# EAGLE design board (EAGLE 6.4)
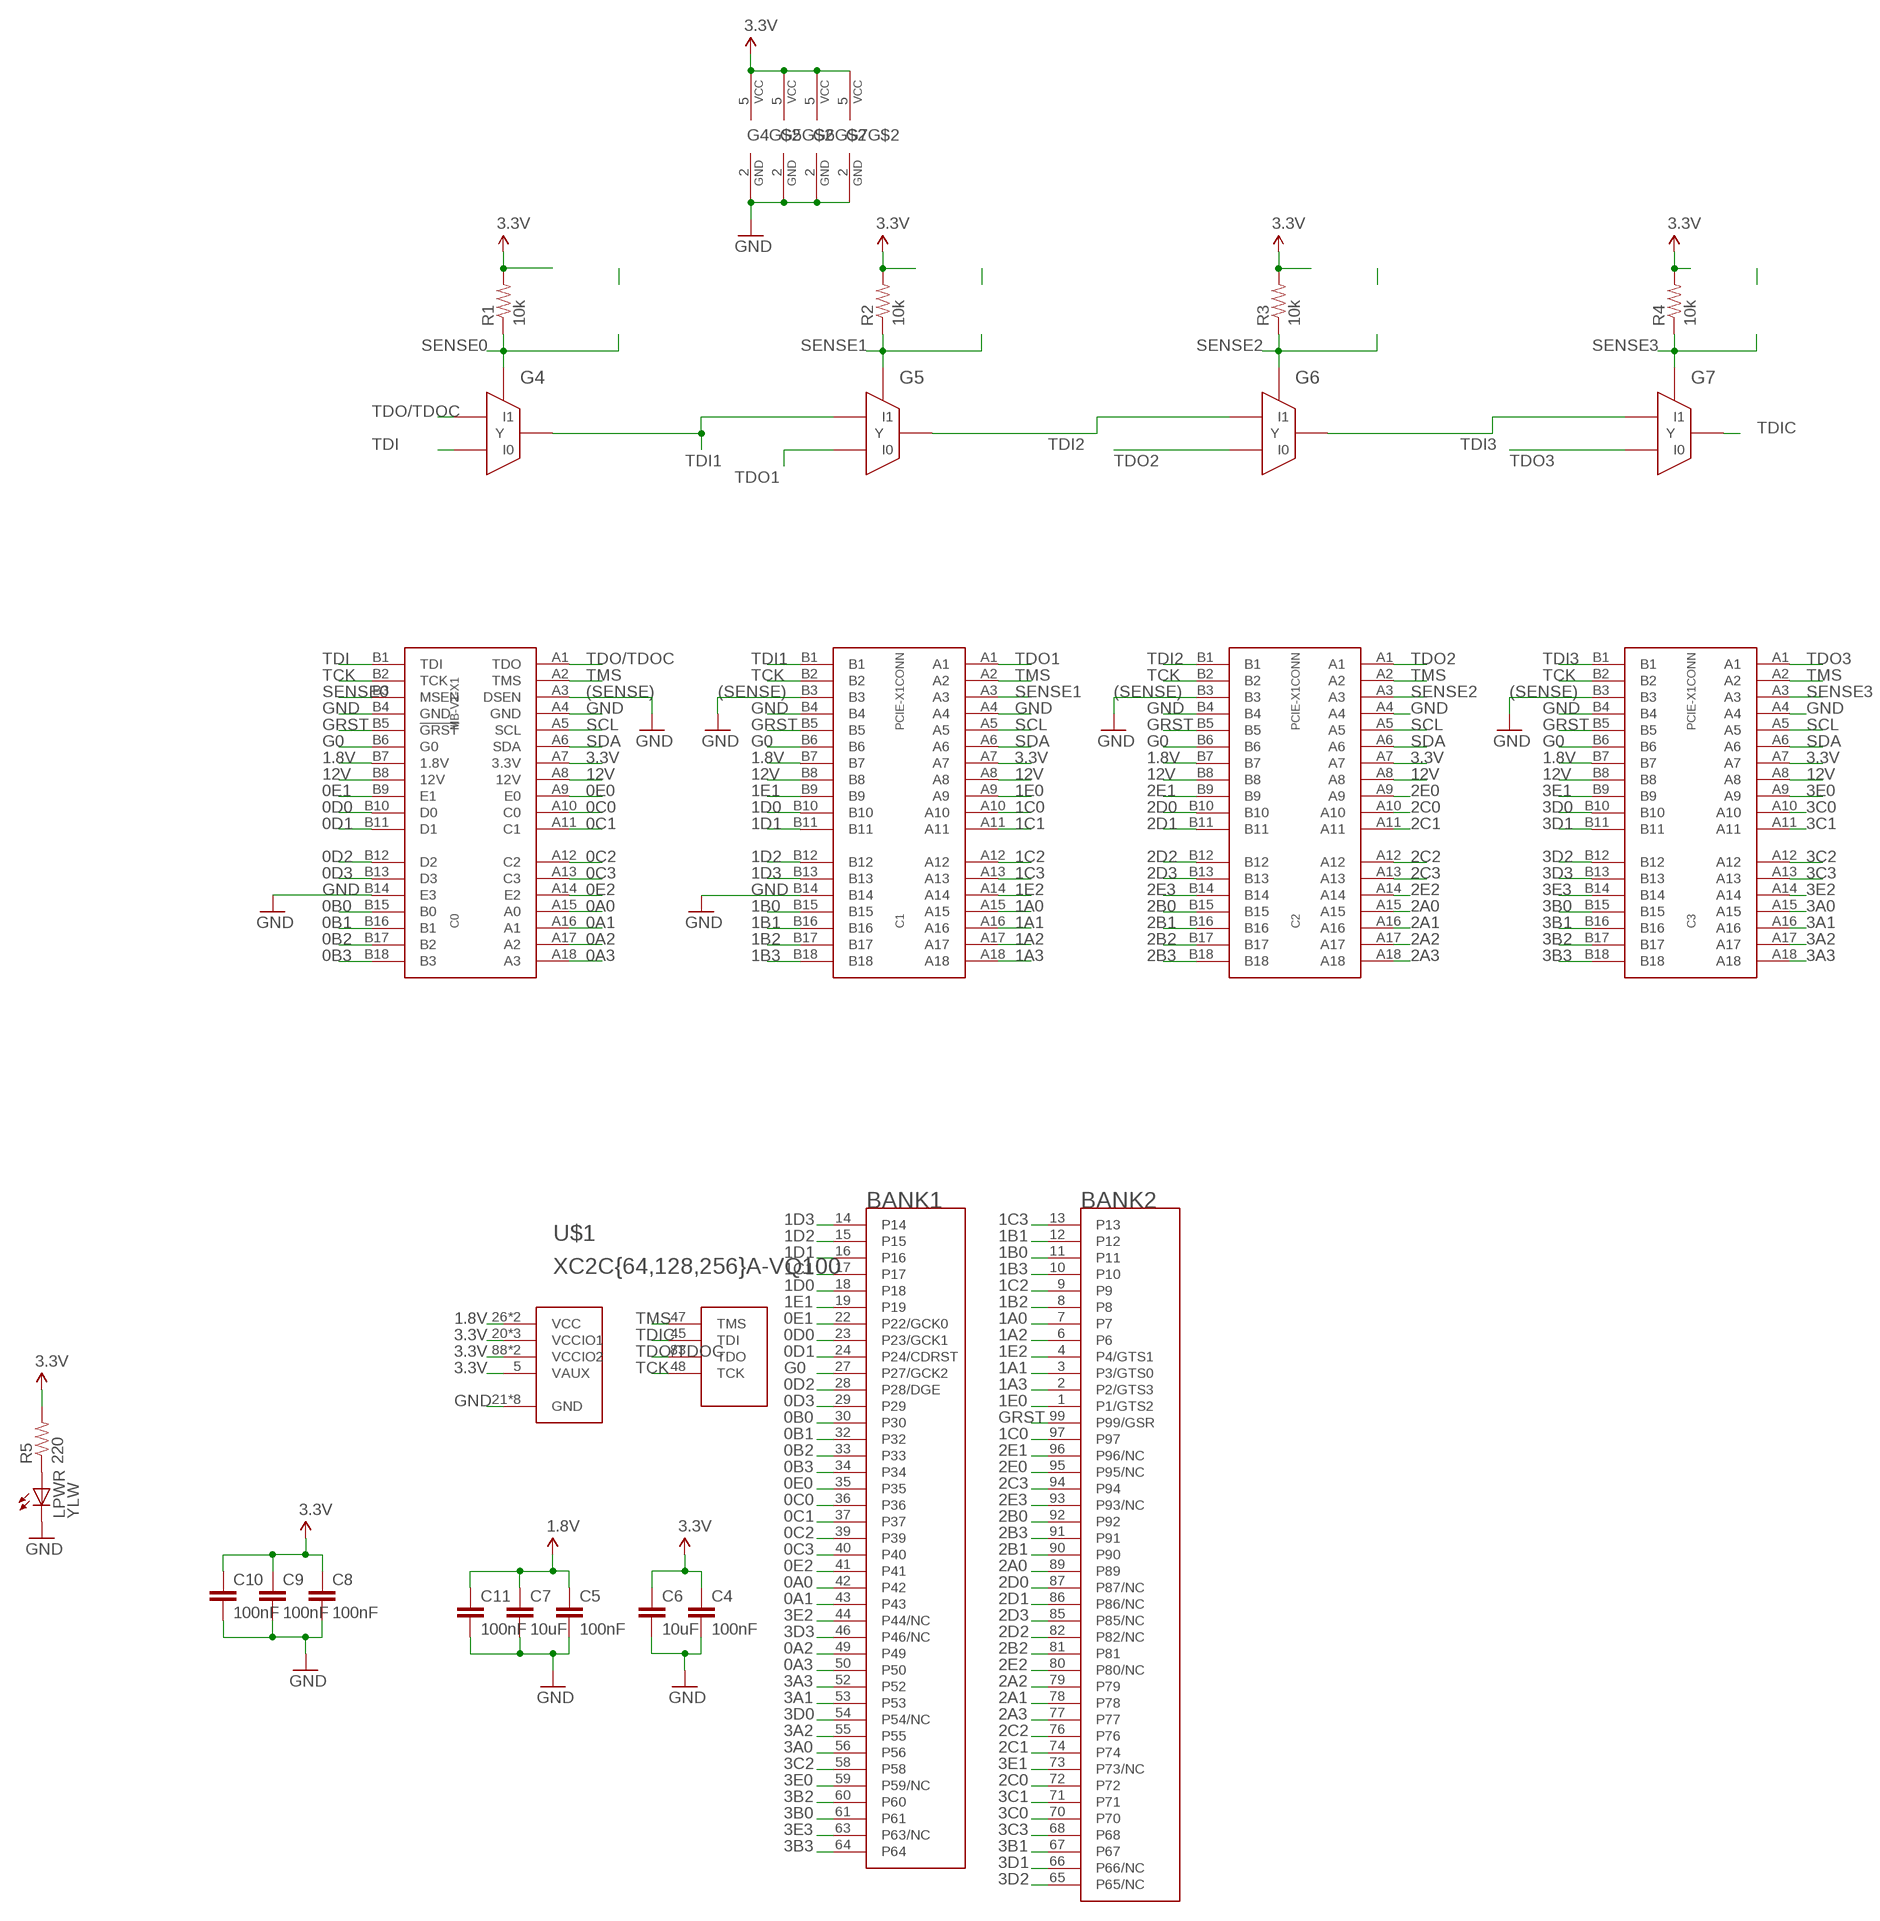
[diagram p0: schematic, sheet 1]

## Parts
C0  MB-V1-X1  [PCIE-X1-EDGE]
C1  PCIE-X1CONN  [PCIE-X1-CONN]
C2  PCIE-X1CONN  [PCIE-X1-CONN]
C3  PCIE-X1CONN  [PCIE-X1-CONN]
C4  100nF  CAP0402-CAP  [0402-CAP]
C5  100nF  CAP0402-CAP  [0402-CAP]
C6  10uF  CAP0805  [0805]
C7  10uF  CAP0805  [0805]
C8  100nF  CAP0402-CAP  [0402-CAP]
C9  100nF  CAP0402-CAP  [0402-CAP]
C10  100nF  CAP0402-CAP  [0402-CAP]
C11  100nF  CAP0402-CAP  [0402-CAP]
G4  74G157  [SOT363]
G5  74G157  [SOT363]
G6  74G157  [SOT363]
G7  74G157  [SOT363]
LPWR  YLW  LED-RED0603  [LED-0603]
R1  10k  RESISTOR0603  [0603-RES]
R2  10k  RESISTOR0603  [0603-RES]
R3  10k  RESISTOR0603  [0603-RES]
R4  10k  RESISTOR0603  [0603-RES]
R5  220  RESISTOR0603  [0603-RES]
U$1  XC2C{64,128,256}A-VQ100  [XILINX_TQ100]

## Nets
0A0: C0.A15(A0) U$1.42
0A1: C0.A16(A1) U$1.43
0A2: C0.A17(A2) U$1.49
0A3: C0.A18(A3) U$1.50
0B0: C0.B15(B0) U$1.30
0B1: C0.B16(B1) U$1.32
0B2: C0.B17(B2) U$1.33
0B3: C0.B18(B3) U$1.34
0C0: C0.A10(C0) U$1.36
0C1: C0.A11(C1) U$1.37
0C2: C0.A12(C2) U$1.39
0C3: C0.A13(C3) U$1.40
0D0: C0.B10(D0) U$1.23(P23/GCK1)
0D1: C0.B11(D1) U$1.24(P24/CDRST)
0D2: C0.B12(D2) U$1.28(P28/DGE)
0D3: C0.B13(D3) U$1.29
0E0: C0.A9(E0) U$1.35
0E1: C0.B9(E1) U$1.22(P22/GCK0)
0E2: C0.A14(E2) U$1.41
1.8V [pwr]: C0.B7(1.8V) C1.B7 C2.B7 C3.B7 C5.1 C7.1 C11.1 U$1.26(VCC) U$1.57(VCC)
1A0: C1.A15 U$1.7
1A1: C1.A16 U$1.3(P3/GTS0)
1A2: C1.A17 U$1.6
1A3: C1.A18 U$1.2(P2/GTS3)
1B0: C1.B15 U$1.11
1B1: C1.B16 U$1.12
1B2: C1.B17 U$1.8
1B3: C1.B18 U$1.10
1C0: C1.A10 U$1.97
1C1: C1.A11 U$1.17
1C2: C1.A12 U$1.9
1C3: C1.A13 U$1.13
1D0: C1.B10 U$1.18
1D1: C1.B11 U$1.16
1D2: C1.B12 U$1.15
1D3: C1.B13 U$1.14
1E0: C1.A9 U$1.1(P1/GTS2)
1E1: C1.B9 U$1.19
1E2: C1.A14 U$1.4(P4/GTS1)
2A0: C2.A15 U$1.89
2A1: C2.A16 U$1.78
2A2: C2.A17 U$1.79
2A3: C2.A18 U$1.77
2B0: C2.B15 U$1.92
2B1: C2.B16 U$1.90
2B2: C2.B17 U$1.81
2B3: C2.B18 U$1.91
2C0: C2.A10 U$1.72
2C1: C2.A11 U$1.74
2C2: C2.A12 U$1.76
2C3: C2.A13 U$1.94
2D0: C2.B10 U$1.87(P87/NC)
2D1: C2.B11 U$1.86(P86/NC)
2D2: C2.B12 U$1.82(P82/NC)
2D3: C2.B13 U$1.85(P85/NC)
2E0: C2.A9 U$1.95(P95/NC)
2E1: C2.B9 U$1.96(P96/NC)
2E2: C2.A14 U$1.80(P80/NC)
2E3: C2.B14 U$1.93(P93/NC)
3.3V [pwr]: C0.A7(3.3V) C1.A7 C2.A7 C3.A7 C4.1 C6.1 C8.1 C9.1 C10.1 G4.5(VCC) G5.5(VCC) G6.5(VCC) G7.5(VCC) R1.2 R2.2 R3.2 R4.2 R5.2 U$1.5(VAUX) U$1.20(VCCIO1) U$1.38(VCCIO1) U$1.51(VCCIO1) U$1.88(VCCIO2) U$1.98(VCCIO2)
3A0: C3.A15 U$1.56
3A1: C3.A16 U$1.53
3A2: C3.A17 U$1.55
3A3: C3.A18 U$1.52
3B0: C3.B15 U$1.61
3B1: C3.B16 U$1.67
3B2: C3.B17 U$1.60
3B3: C3.B18 U$1.64
3C0: C3.A10 U$1.70
3C1: C3.A11 U$1.71
3C2: C3.A12 U$1.58
3C3: C3.A13 U$1.68
3D0: C3.B10 U$1.54(P54/NC)
3D1: C3.B11 U$1.66(P66/NC)
3D2: C3.B12 U$1.65(P65/NC)
3D3: C3.B13 U$1.46(P46/NC)
3E0: C3.A9 U$1.59(P59/NC)
3E1: C3.B9 U$1.73(P73/NC)
3E2: C3.A14 U$1.44(P44/NC)
3E3: C3.B14 U$1.63(P63/NC)
12V [pwr]: C0.A8(12V) C0.B8(12V) C1.A8 C1.B8 C2.A8 C2.B8 C3.A8 C3.B8
G0: C0.B6(G0) C1.B6 C2.B6 C3.B6 U$1.27(P27/GCK2)
GND [pwr]: C0.A3(DSEN) C0.A4(GND) C0.B4(GND) C0.B14(E3) C1.A4 C1.B3 C1.B4 C1.B14 C2.A4 C2.B3 C2.B4 C3.A4 C3.B3 C3.B4 C4.2 C5.2 C6.2 C7.2 C8.2 C9.2 C10.2 C11.2 G4.2(GND) G5.2(GND) G6.2(GND) G7.2(GND) LPWR.C U$1.21(GND) U$1.25(GND) U$1.31(GND) U$1.62(GND) U$1.69(GND) U$1.75(GND) U$1.84(GND) U$1.100(GND)
GRST: C0.B5(!GRST) C1.B5 C2.B5 C3.B5 U$1.99(P99/GSR)
N$25: LPWR.A R5.1
SCL: C0.A5(SCL) C1.A5 C2.A5 C3.A5
SDA: C0.A6(SDA) C1.A6 C2.A6 C3.A6
SENSE0: C0.B3(MSEN) G4.6(S) R1.1
SENSE1: C1.A3 G5.6(S) R2.1
SENSE2: C2.A3 G6.6(S) R3.1
SENSE3: C3.A3 G7.6(S) R4.1
TCK: C0.B2(TCK) C1.B2 C2.B2 C3.B2 U$1.48(TCK)
TDI: C0.B1(TDI) G4.3(I0)
TDI1: C1.B1 G4.4(Y) G5.1(I1)
TDI2: C2.B1 G5.4(Y) G6.1(I1)
TDI3: C3.B1 G6.4(Y) G7.1(I1)
TDIC: G7.4(Y) U$1.45(TDI)
TDO1: C1.A1 G5.3(I0)
TDO2: C2.A1 G6.3(I0)
TDO3: C3.A1 G7.3(I0)
TDO/TDOC: C0.A1(TDO) G4.1(I1) U$1.83(TDO)
TMS: C0.A2(TMS) C1.A2 C2.A2 C3.A2 U$1.47(TMS)

## Notes on the sheet
- (SENSE) | (SENSE) | (SENSE) | (SENSE)

## Library data of the parts
C0 = kmod-connectors:MB-V1-X1
C1-C3 = kmod-connectors:PCIE-X1
C4-C11 = kmod-passives:CAP: Capacitor Standard 0603 ceramic capacitor, and 0.1" leaded capacitor.
G4-G7 = kmod-testing:74G157: Single gate mux Similar to the 74*157, but with just a single gate. This is the pinout used by Fairchild/NXP/Toshiba, but the TI parts swap the select (S) and output (Y) pins.
LPWR = SparkFun-LED:LED-RED: Assorted Red LEDs LilyPad 1206- DIO-09912 1206- DIO-00809 0603- DIO-00819; PROD_ID: DIO-00819; VALUE: RED
R1-R4 = kmod-passives:RESISTOR: Resistor Basic schematic elements and footprints for 0603, 1206, and PTH resistors.
R5 = SparkFun-Resistors:RESISTOR: Resistor Basic schematic elements and footprints for 0603, 1206, and PTH resistors.
U$1 = kmod-xilinx:XC2C{64,128,256}A-VQ100

## Board
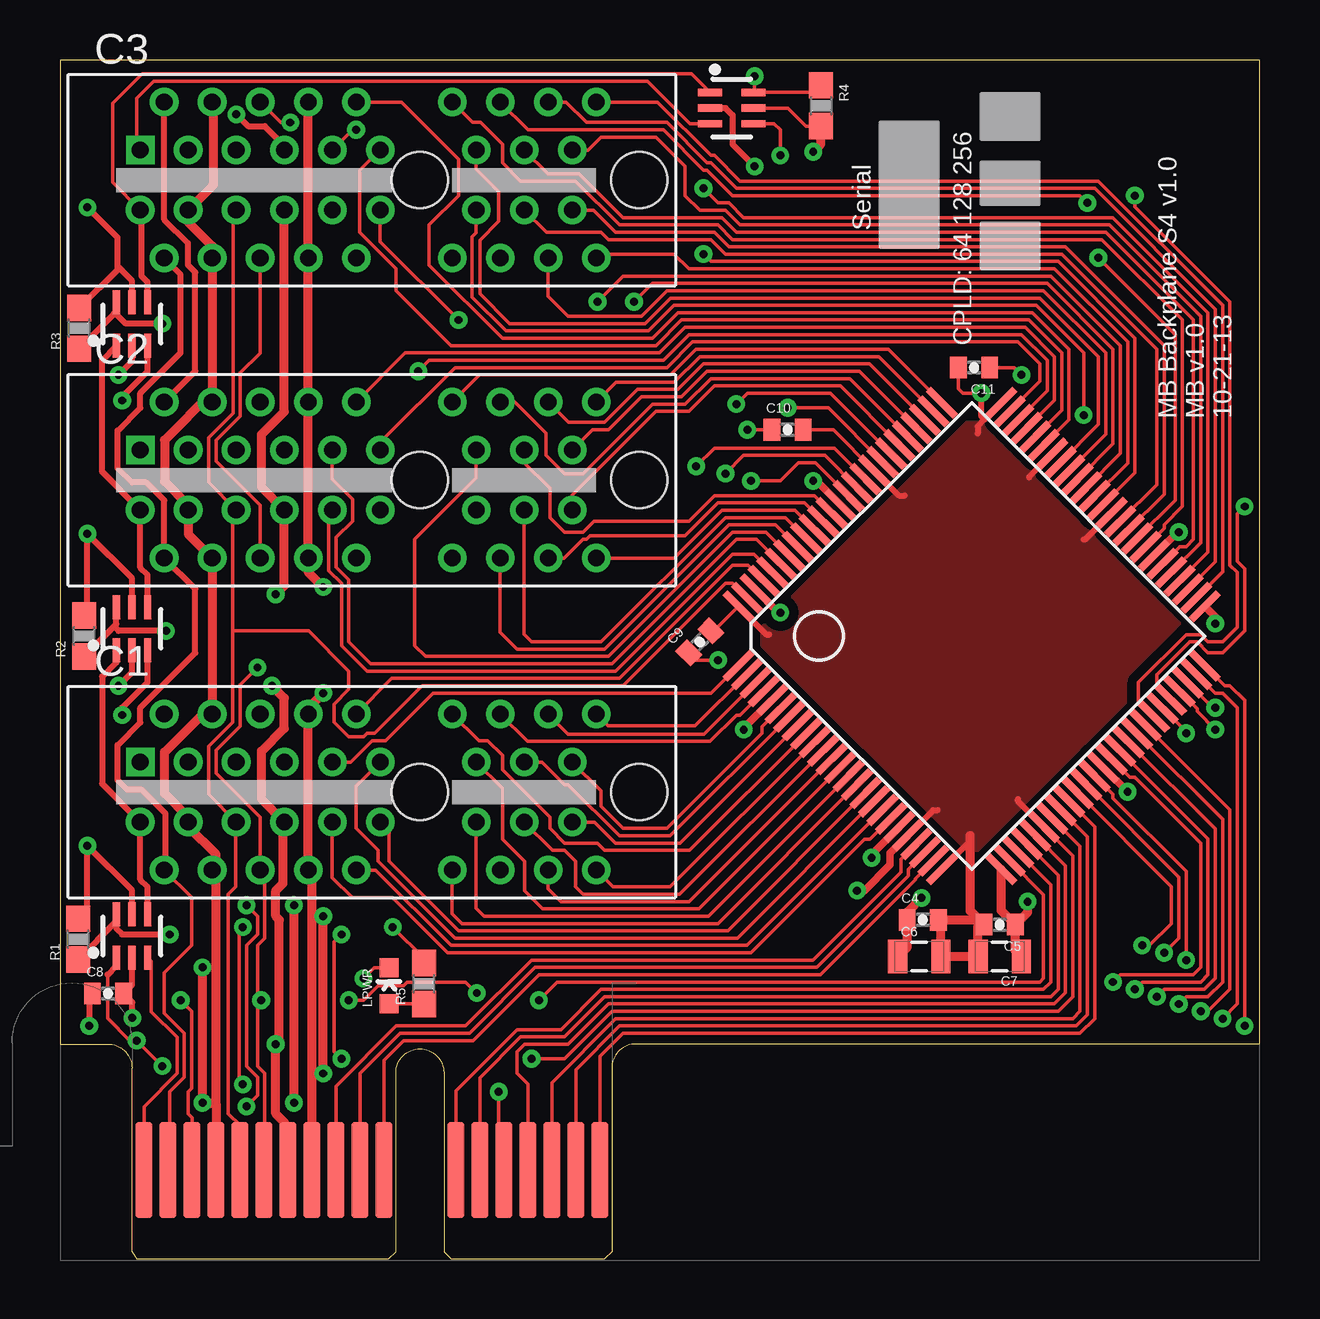
[diagram p1: board, top side]
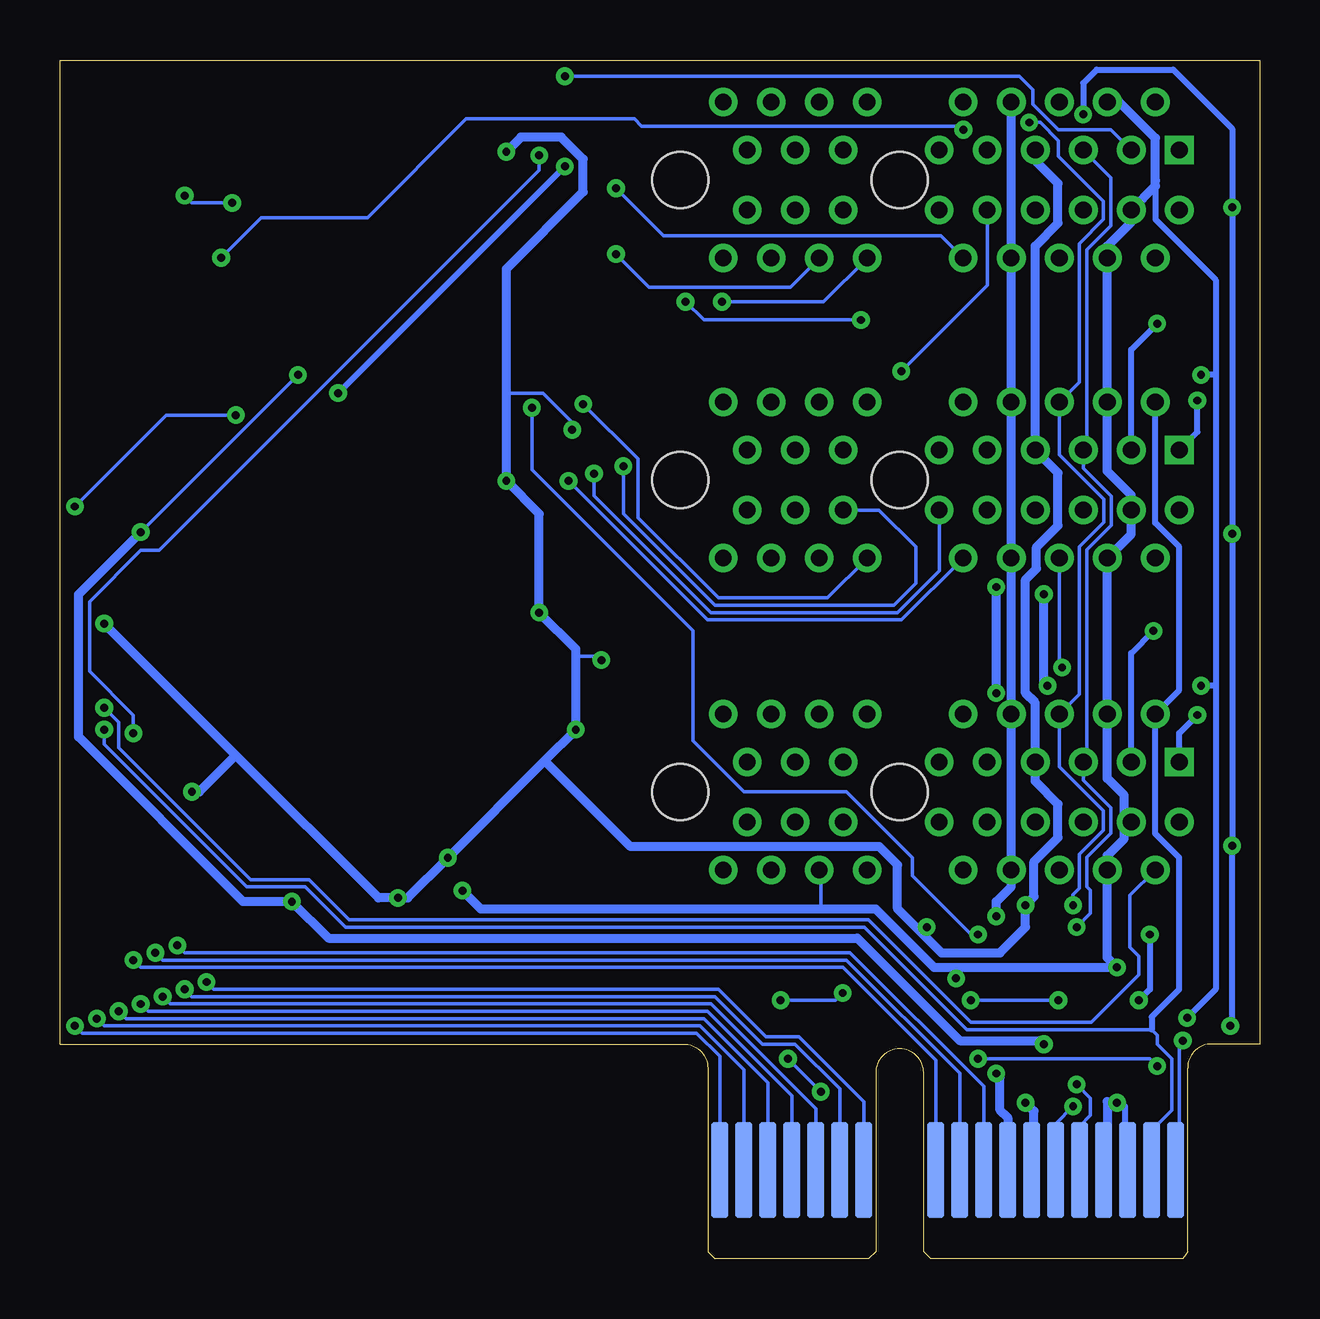
[diagram p2: board, bottom side, seen from below]

Size 50 x 49.95 mm. Coordinates in mm from the lower left corner, seen from the top.
Outline: 3,7.95 arc90 2,8.95 0,8.95 0,49.95 50,49.95 50,8.95 24,8.95 arc90 23,7.95
Copper layers (1*16): Top 0.035mm / dielectric 1.5mm / Bottom 0.035mm
Design rules "SeeedStudio_mine": minimum track width 6mil, minimum drill 12mil, track to track 6mil, track to pad 6mil, pad to pad 6mil, via to via 6mil, smd to smd 6mil, copper to edge 10mil, drill to drill 10mil, minimum pad ring 6mil, minimum via ring 8mil, stop-mask expansion 2mil, vias tented up to drill 25mil, thermal gap 10mil

### Footprints (pad centres in the part's own frame; a part is rotated, then mirrored left to right if it is on the bottom)
PCIE-X1-EDGE = smd 0.7 x 4 bottom: A1 -11.5,-0.75; A2 -10.5,-0.75; A3 -9.5,-0.75; A4 -8.5,-0.75; A5 -7.5,-0.75; A6 -6.5,-0.75; A7 -5.5,-0.75; A8 -4.5,-0.75; A9 -3.5,-0.75; A10 -2.5,-0.75; A11 -1.5,-0.75; A12 1.5,-0.75; A13 2.5,-0.75; A14 3.5,-0.75; A15 4.5,-0.75; A16 5.5,-0.75; A17 6.5,-0.75; A18 7.5,-0.75 | smd 0.7 x 4: B1 -11.5,-0.75; B2 -10.5,-0.75; B3 -9.5,-0.75; B4 -8.5,-0.75; B5 -7.5,-0.75; B6 -6.5,-0.75; B7 -5.5,-0.75; B8 -4.5,-0.75; B9 -3.5,-0.75; B10 -2.5,-0.75; B11 -1.5,-0.75; B12 1.5,-0.75; B13 2.5,-0.75; B14 3.5,-0.75; B15 4.5,-0.75; B16 5.5,-0.75; B17 6.5,-0.75; B18 7.5,-0.75
PCIE-X1-CONN = drill 0.7 pad 1.2 square: A1 -11.65,1.25 | drill 0.7 pad 1.2: A2 -10.65,3.25; A3 -9.65,1.25; A4 -8.65,3.25; A5 -7.65,1.25; A6 -6.65,3.25; A7 -5.65,1.25; A8 -4.65,3.25; A9 -3.65,1.25; A10 -2.65,3.25; A11 -1.65,1.25; A12 1.35,3.25; A13 2.35,1.25; A14 3.35,3.25; A15 4.35,1.25; A16 5.35,3.25; A17 6.35,1.25; A18 7.35,3.25; B1 -11.65,-1.25; B2 -10.65,-3.25; B3 -9.65,-1.25; B4 -8.65,-3.25; B5 -7.65,-1.25; B6 -6.65,-3.25; B7 -5.65,-1.25; B8 -4.65,-3.25; B9 -3.65,-1.25; B10 -2.65,-3.25; B11 -1.65,-1.25; B12 1.35,-3.25; B13 2.35,-1.25; B14 3.35,-3.25; B15 4.35,-1.25; B16 5.35,-3.25; B17 6.35,-1.25; B18 7.35,-3.25 | hole 2.35: 0,0; 9.15,0
0402-CAP = smd 0.7 x 0.9: 1 -0.65,0; 2 0.65,0
0805 = smd 0.8 x 1.4: 1 -0.9,0; 2 0.9,0
SOT363 = smd 0.3 x 1: 1 -0.65,-0.9; 2 0,-0.9; 3 0.65,-0.9; 4 0.65,0.9; 5 0,0.9; 6 -0.65,0.9
LED-0603 = smd 0.8 x 0.8: A 0,-0.75; C 0,0.75
0603-RES = smd 1.1 x 1: 1 -0.85,0; 2 0.85,0
XILINX_TQ100 = smd 0.3 x 1.6: 1 -6,-7.75; 2 -5.5,-7.75; 3 -5,-7.75; 4 -4.5,-7.75; 5 -4,-7.75; 6 -3.5,-7.75; 7 -3,-7.75; 8 -2.5,-7.75; 9 -2,-7.75; 10 -1.5,-7.75; 11 -1,-7.75; 12 -0.5,-7.75; 13 0,-7.75; 14 0.5,-7.75; 15 1,-7.75; 16 1.5,-7.75; 17 2,-7.75; 18 2.5,-7.75; 19 3,-7.75; 20 3.5,-7.75; 21 4,-7.75; 22 4.5,-7.75; 23 5,-7.75; 24 5.5,-7.75; 25 6,-7.75; 51 6,7.75; 52 5.5,7.75; 53 5,7.75; 54 4.5,7.75; 55 4,7.75; 56 3.5,7.75; 57 3,7.75; 58 2.5,7.75; 59 2,7.75; 60 1.5,7.75; 61 1,7.75; 62 0.5,7.75; 63 0,7.75; 64 -0.5,7.75; 65 -1,7.75; 66 -1.5,7.75; 67 -2,7.75; 68 -2.5,7.75; 69 -3,7.75; 70 -3.5,7.75; 71 -4,7.75; 72 -4.5,7.75; 73 -5,7.75; 74 -5.5,7.75; 75 -6,7.75 | smd 1.6 x 0.3: 26 7.75,-6; 27 7.75,-5.5; 28 7.75,-5; 29 7.75,-4.5; 30 7.75,-4; 31 7.75,-3.5; 32 7.75,-3; 33 7.75,-2.5; 34 7.75,-2; 35 7.75,-1.5; 36 7.75,-1; 37 7.75,-0.5; 38 7.75,0; 39 7.75,0.5; 40 7.75,1; 41 7.75,1.5; 42 7.75,2; 43 7.75,2.5; 44 7.75,3; 45 7.75,3.5; 46 7.75,4; 47 7.75,4.5; 48 7.75,5; 49 7.75,5.5; 50 7.75,6; 76 -7.75,6; 77 -7.75,5.5; 78 -7.75,5; 79 -7.75,4.5; 80 -7.75,4; 81 -7.75,3.5; 82 -7.75,3; 83 -7.75,2.5; 84 -7.75,2; 85 -7.75,1.5; 86 -7.75,1; 87 -7.75,0.5; 88 -7.75,0; 89 -7.75,-0.5; 90 -7.75,-1; 91 -7.75,-1.5; 92 -7.75,-2; 93 -7.75,-2.5; 94 -7.75,-3; 95 -7.75,-3.5; 96 -7.75,-4; 97 -7.75,-4.5; 98 -7.75,-5; 99 -7.75,-5.5; 100 -7.75,-6

### Placement (x,y rotation side)
C0  15,4.45 0 top
C1  15,19.45 0 top
C2  15,32.45 0 top
C3  15,44.95 0 top
C4  35.97,14.12 0 top
C5  39.17,13.92 180 top
C6  35.81,12.6 0 top
C7  39.17,12.6 180 top
C8  2,11.05 0 top
C9  26.67,25.71 45 top
C10  30.33,34.54 0 top
C11  38.1,37.14 180 top
G4  3,13.45 0 top
G5  3,26.25 0 top
G6  3,38.95 0 top
G7  28,47.95 270 top
LPWR  13.72,11.38 0 top
R1  0.76,13.32 90 top
R2  1,25.95 90 top
R3  0.8,38.77 90 top
R4  31.71,48.05 270 top
R5  15.17,11.47 90 top
U$1  38,25.95 315 top

### Tracks (layer width: path | path; a pad name or v marks a point on that pad's centre or on a via)
0A0  (via drill 0.33)
  Top 0.152: U$1.42 48.46,18.31 48.46,11.53 47.85,10.92 46.94,10.92 v46.63,10.62
  Bottom 0.152: C0.A15 19.5,6.8 23.01,10.31 46.33,10.31 v46.63,10.62
0A1  (via drill 0.33)
  Top 0.152: U$1.43 48.77,18.72 48.77,11.23 47.85,10.31 v47.55,10.31
  Bottom 0.152: C0.A16 20.5,7.34 23.16,10.01 47.24,10.01 v47.55,10.31
0A2  (via drill 0.33)
  Top 0.152: v48.46,10.01 49.07,10.62 49.07,22.96 48.46,23.57 48.16,23.57 U$1.49
  Bottom 0.152: C0.A17 21.5,7.89 23.32,9.7 48.16,9.7 v48.46,10.01
0A3  (via drill 0.33)
  Top 0.152: v49.38,9.7 49.38,23.27 48.77,23.88 48.56,23.88 U$1.50
  Bottom 0.152: C0.A18 22.5,8.43 23.47,9.4 49.07,9.4 v49.38,9.7
0B0
  Top 0.152: C0.B15 19.5,7.27 19.05,7.72 19.05,8.64 19.36,8.94 21.18,8.94 22.86,10.62 41.45,10.62 41.91,11.07 41.91,16.38 U$1.30
0B1
  Top 0.152: C0.B16 20.5,7.34 23.16,10.01 42.22,10.01 42.52,10.31 42.52,17.19 U$1.32
0B2
  Top 0.152: C0.B17 21.5,7.89 23.32,9.7 42.37,9.7 42.82,10.16 42.82,17.59 U$1.33
0B3
  Top 0.152: C0.B18 22.5,8.43 23.47,9.4 42.52,9.4 43.13,10.01 43.13,17.99 U$1.34
0C0  (via drill 0.33)
  Top 0.152: v46.02,12.75 46.63,13.36 46.63,15.9 U$1.36
  Bottom 0.152: C0.A10 12.5,7.73 17.22,12.45 45.72,12.45 v46.02,12.75
0C1  (via drill 0.33)
  Top 0.152: v46.94,12.45 46.94,16.15 43.89,19.2 43.89,19.35 U$1.37
  Bottom 0.152: C0.A11 13.5,8.27 17.37,12.14 46.63,12.14 v46.94,12.45
0C2  (via drill 0.33)
  Top 0.152: v43.89,11.53 44.2,11.84 47.24,11.84 47.55,12.14 47.55,17.32 44.81,20.07 44.59,20.07 U$1.39
  Bottom 0.152: C0.A12 16.5,6.54 19.2,9.25 20.57,9.25 22.55,11.23 43.59,11.23 v43.89,11.53
0C3  (via drill 0.33)
  Top 0.152: U$1.40 47.85,17.51 47.85,11.84 47.55,11.53 45.11,11.53 v44.81,11.23
  Bottom 0.152: C0.A13 17.5,7.09 19.36,8.94 20.73,8.94 22.71,10.92 44.5,10.92 v44.81,11.23
0D0
  Top 0.152: C0.B10 12.5,7.73 14.17,9.4 17.07,9.4 19.81,12.14 31.55,12.14 35.36,15.95 35.36,16.24 U$1.23
0D1
  Top 0.152: C0.B11 13.5,8.27 14.33,9.09 17.22,9.09 19.96,11.84 31.7,11.84 35.66,15.8 35.66,15.83 U$1.24
0D2
  Top 0.152: C0.B12 16.5,7 19.05,9.55 20.88,9.55 22.55,11.23 41,11.23 41.3,11.53 41.3,15.58 U$1.28
0D3
  Top 0.152: C0.B13 17.5,7.54 19.2,9.25 21.03,9.25 22.71,10.92 41.3,10.92 41.6,11.23 41.6,15.98 U$1.29
0E0  (via drill 0.33)
  Top 0.152: v45.11,13.06 45.41,13.06 46.33,13.97 46.33,15.5 U$1.35
  Bottom 0.152: C0.A9 11.5,7.18 17.07,12.75 44.81,12.75 v45.11,13.06
0E1
  Top 0.152: C0.B9 11.5,7.18 14.02,9.7 16.92,9.7 19.66,12.45 31.39,12.45 35.05,16.1 35.05,16.64 U$1.22
0E2  (via drill 0.33)
  Top 0.152: U$1.41 48.16,17.91 48.16,11.68 47.7,11.23 46.02,11.23 v45.72,10.92
  Bottom 0.152: C0.A14 18.5,6.26 22.86,10.62 45.41,10.62 v45.72,10.92
1.8V  (via drill 0.33)
  Top 0.152: C11.1 39.78,37.14 v40.08,36.83
  Top 0.254: 46.57,30.28 v46.63,30.28 | U$1.57
  Top 0.305: U$1.57 46.57,30.28
  Top 0.381: C0.B7 9.35,3.85 9.35,5.69 8.99,6.05 v8.99,8.94 9.14,9.09 9.14,14.12 8.99,14.28 8.99,15.34 9.3,15.65 9.3,18.15 C1.B7 8.4,19.15 8.4,21.15 9.35,22.1 9.35,23.37 v8.84,23.88 | C3.B7 9.35,35.3 8.4,34.35 8.4,32.15 C2.B7 9.35,28.04 v8.99,27.69 | U$1.26 39.24,14.5 C5.1 | v40.33,14.89 40.33,14.44 C5.1 | C7.1 39.82,12.85 C5.1
  Bottom 0.152: v40.08,36.83 v46.63,30.28
  Bottom 0.381: v46.63,30.28 49.23,27.69 49.23,21.74 42.37,14.89 v40.33,14.89 38.81,13.36 16.76,13.36 12.5,9.09 9.14,9.09 v8.99,8.94 | v8.84,23.88 8.99,24.03 v8.99,27.69
1A0
  Top 0.152: C1.A15 20.09,20.7 21.03,19.76 21.18,19.76 23.32,17.63 25.44,17.63 U$1.7
1A1
  Top 0.152: C1.A16 21.18,21.87 26.84,21.87 U$1.3
1A2
  Top 0.152: C1.A17 22.55,19.5 22.55,18.85 23.47,17.93 25.3,17.93 29.26,21.9 29.26,22.16 U$1.6
1A3
  Top 0.152: C1.A18 22.85,22.2 26.47,22.2 U$1.2
1B0
  Top 0.152: C1.B15 20.53,17.02 21.03,17.02 21.49,16.56 21.49,15.5 21.79,15.19 25.83,15.19 U$1.11
1B1
  Top 0.152: C1.B16 20.35,15.41 20.88,14.89 26.23,14.89 U$1.12
1B2
  Top 0.152: C1.B17 22.29,18.2 23.16,17.32 25.84,17.32 U$1.8
1B3
  Top 0.152: C1.B18 23.05,15.5 25.42,15.5 U$1.10
1C0
  Top 0.152: C1.A10 13.83,24.18 23.32,24.18 28.04,28.91 28.68,28.91 U$1.97
1C1
  Top 0.152: C1.A11 12.34,19.69 12.34,17.93 13.26,17.02 13.26,16.56 16.46,13.36 28.24,13.36 U$1.17
1C2
  Top 0.152: C1.A12 17.46,21.59 17.83,21.59 18.44,20.98 18.44,20.37 20.42,18.39 20.42,17.93 21.03,17.32 22.4,17.32 22.71,17.02 26.24,17.02 U$1.9
1C3
  Top 0.152: C1.A13 18.44,19.61 18.44,17.48 19.36,16.56 19.36,15.34 20.12,14.58 26.63,14.58 U$1.13
1D0
  Top 0.152: U$1.18 28.64,13.06 16.31,13.06 13.16,16.2 C1.B10
1D1
  Top 0.152: C1.B11 13.72,17.83 13.72,16.56 16.61,13.67 27.84,13.67 U$1.16
1D2
  Top 0.152: C1.B12 16.35,14.39 16.76,13.97 27.43,13.97 U$1.15
1D3
  Top 0.152: C1.B13 17.35,14.6 17.68,14.28 27.03,14.28 U$1.14
1E0
  Top 0.152: U$1.1 27.14,23.57 15.54,23.57 13.56,21.59 13,21.59 12.11,20.7 C1.A9
1E1
  Top 0.152: U$1.19 33.77,17.48 33.53,17.48 28.8,12.75 16.15,12.75 13.87,15.04 12.19,15.04 11.35,15.88 C1.B9
1E2
  Top 0.152: C1.A14 19.49,21.56 27.1,21.56 28.19,22.66 28.34,22.66 U$1.4
2A0
  Top 0.152: U$1.89 31.44,31.8 27.28,31.8 26.21,30.73 22.25,30.73 21.79,30.28 21.03,30.28 20.42,30.89 20.42,32.11 19.35,33.18 C2.A15
2A1
  Top 0.152: C2.A16 21.2,34.85 22.71,34.85 24.08,36.22 25.76,36.22 26.82,37.29 33.73,37.29 34.8,36.22 35,36.02 U$1.78
2A2
  Top 0.152: C2.A17 22.2,34.55 22.86,34.55 24.23,35.92 25.91,35.92 26.98,36.98 33.33,36.98 U$1.79
2A3
  Top 0.152: C2.A18 23.18,36.53 25.6,36.53 26.67,37.59 34.13,37.59 U$1.77
2B0
  Top 0.152: U$1.92 30.23,30.89 27.74,30.89 22.55,25.71 19.66,25.71 19.35,26.02 C2.B15
2B1
  Top 0.152: U$1.90 31.04,31.5 27.43,31.5 26.06,30.12 22.1,30.12 21.95,29.97 21.79,29.97 21.02,29.2 C2.B16
2B2
  Top 0.152: U$1.81 32.53,36.37 27.28,36.37 26.21,35.31 24.84,35.31 21.35,31.82 C2.B17
2B3
  Top 0.152: U$1.91 30.64,31.19 27.58,31.19 25.59,29.2 C2.B18
2C0
  Top 0.152: U$1.72 41.45,35.77 41.45,37.59 40.23,38.81 26.06,38.81 24.99,37.75 14.39,37.75 C2.A10
2C1
  Top 0.152: C2.A11 13.41,33.76 13.41,34.09 16.46,37.14 25.3,37.14 26.36,38.2 39.93,38.2 40.84,37.29 40.84,36.57 U$1.74
2C2
  Top 0.152: C2.A12 17.48,36.83 25.45,36.83 26.52,37.9 34.54,37.9 U$1.76
2C3
  Top 0.152: U$1.94 29.43,30.28 28.04,30.28 22.86,25.1 15.24,25.1 14.78,25.55 14.78,29.97 17.35,32.54 C2.A13
2D0  (via drill 0.33)
  Top 0.152: U$1.87 31.48,33.17 30.79,33.17 30.02,32.41 v28.8,32.41
  Bottom 0.152: v28.8,32.41 23.01,26.62 14.93,26.62 C2.B10
2D1  (via drill 0.33)
  Top 0.152: U$1.86 31.89,33.48 28.5,33.48 v27.74,32.72
  Bottom 0.152: v27.74,32.72 27.74,31.8 22.86,26.93 15.09,26.93 13.35,28.66 C2.B11
2D2  (via drill 0.33)
  Top 0.152: U$1.82 32.12,36.07 28.65,36.07 v28.19,35.61
  Bottom 0.152: v28.19,35.61 25.91,33.33 25.91,30.89 22.55,27.53 18.02,27.53 C2.B12
2D3  (via drill 0.33)
  Top 0.152: U$1.85 32.29,33.78 27.28,33.78 v26.52,33.02
  Bottom 0.152: v26.52,33.02 26.52,31.04 22.71,27.23 15.24,27.23 14.33,28.14 14.33,29.67 15.86,31.2 C2.B13
2E0
  Top 0.152: C2.A9 11.35,32.49 12.19,31.65 12.19,30.73 11.51,30.05 11.51,28.82 12.04,28.3 12.04,25.71 12.95,24.79 23.01,24.79 28.19,29.97 29.03,29.97 U$1.95
2E1
  Top 0.152: C2.B9 11.21,31.06 11.21,28.67 11.73,28.14 11.73,25.55 12.8,24.49 23.16,24.49 28.04,29.36 28.93,29.36 U$1.96
2E2
  Top 0.152: C2.A14 18.96,35.7 20.27,34.39 20.27,33.48 21.03,32.72 21.79,32.72 24.69,35.61 26.06,35.61 27.13,36.68 32.93,36.68 U$1.80
2E3
  Top 0.152: C2.B14 18.35,26.1 19.05,25.4 22.71,25.4 27.89,30.58 29.83,30.58 U$1.93
3.3V  (via drill 0.33)
  Top 0.152: G7.5 30.33,47.95 31.08,47.2 R4.2 | R5.2 15.17,12.52 v13.87,13.82 | C9.1 26.51,24.94 v27.43,24.94 | C10.1 v28.65,34.55
  Top 0.254: G5.5 3,28.35 v1.14,30.21 1.14,26.94 R2.2 | G4.5 3,15.35 v1.14,17.21 1.14,14.55 R1.2 | G6.5 3,40.75 2.4,41.35 | 2.4,41.35 2.4,42.55 v1.14,43.81 | R3.2 2.4,41.22 2.4,41.35 | C8.1 1.33,11.07 1.22,10.96 v1.22,9.7 | v7.35,47.68 7.83,47.19 8.53,47.19 9.35,46.38 C3.A7
  Top 0.305: v48.16,26.47 48.16,26.75 U$1.51 | v44.5,19.46 U$1.38 | v31.39,32.41 31.54,32.41 U$1.88 | U$1.98 29.95,26.93 v30.02,26.93 | v28.5,22.05 28.5,22.11 U$1.5 | v33.83,16.71 33.83,16.83 U$1.20
  Top 0.381: C6.1 35.32,13 C4.1 35.32,14.44 v35.91,15.04 | v9.75,6.5 v9.75,14.73 | v31.39,46.13 31.71,46.45 R4.2
  Bottom 0.152: v13.87,13.82 14.1,13.59 | v27.43,24.94 27.58,25.1 28.5,25.1 | v28.65,34.55 28.65,34.85 29.87,36.07 31.39,36.07
  Bottom 0.254: C3.A7 9.4,46.25 | v1.22,9.7 1.14,9.78 v1.14,17.21 v1.14,30.21 v1.14,43.81 1.14,47.09 3.6,49.55 6.79,49.55 7.35,48.99 v7.35,47.68
  Bottom 0.381: C0.A7 9.4,3.8 9.4,6.15 v9.75,6.5 | C3.A7 9.35,45.76 8.4,44.81 8.4,43.15 9.35,42.2 C2.A7 8.4,32.75 8.4,30.55 9.3,29.65 9.3,28.75 9.75,28.3 9.75,23.57 9.35,23.17 C1.A7 9.35,19.9 8.4,18.95 8.4,17.55 9.4,16.55 9.4,15.09 v9.75,14.73 9.75,13.82 10.82,12.75 13.26,12.75 14.1,13.59 15.09,14.58 15.09,16.41 15.85,17.17 26.21,17.17 29.79,20.75 | 42.67,20.98 36.73,15.04 v35.91,15.04 35.51,15.04 v33.83,16.71 29.79,20.75 | 42.67,20.98 v48.16,26.47 | 42.67,20.98 44.2,19.46 v44.5,19.46 | 29.79,20.75 v28.5,22.05 28.5,25.1 28.5,25.4 v30.02,26.93 30.02,31.04 v31.39,32.41 31.39,36.07 31.39,41.25 28.19,44.45 28.19,45.82 29.11,46.74 30.79,46.74 v31.39,46.13
3A0
  Top 0.152: C3.A15 20.34,45.21 21.64,45.21 23.47,43.38 27.58,43.38 28.19,42.77 43.59,42.77 47.24,39.12 47.24,29.97 46.94,29.67 46.67,29.67 U$1.56
3A1
  Top 0.152: C3.A16 21.09,48.2 21.95,47.35 25.3,47.35 26.98,45.67 27.13,45.67 28.19,44.6 43.13,44.6 48.16,39.57 48.16,29.04 U$1.53
3A2
  Top 0.152: C3.A17 22.02,46.2 22.55,46.74 24.84,46.74 26.06,45.52 26.06,44.3 26.67,43.69 27.74,43.69 28.35,43.08 43.74,43.08 47.55,39.27 47.55,29.84 U$1.55
3A3
  Top 0.152: C3.A18 24.9,48.2 27.13,45.98 27.28,45.98 28.35,44.91 43.28,44.91 48.46,39.73 48.46,28.63 U$1.52
3B0
  Top 0.152: C3.B15 20.28,42.77 22.55,42.77 22.86,42.47 27.13,42.47 27.74,41.86 41.76,41.86 45.72,37.9 45.72,32.26 U$1.61
3B1
  Top 0.152: U$1.67 43.59,34.37 43.59,37.75 41,40.34 25.3,40.34 24.23,39.27 21.18,39.27 20.35,40.1 C3.B16
3B2
  Top 0.152: C3.B17 22.24,43.7 23.16,42.77 27.28,42.77 27.89,42.17 41.91,42.17 46.02,38.05 46.02,31.85 U$1.60
3B3
  Top 0.152: C3.B18 22.51,41.86 25.6,41.86 26.21,41.25 41.45,41.25 44.5,38.2 44.5,33.16 U$1.64
3C0
  Top 0.152: C3.A10 14.23,48.2 16.61,45.82 16.61,44.3 15.39,43.08 15.39,41.4 18.44,38.36 24.69,38.36 25.76,39.42 40.54,39.42 42.06,37.9 42.06,34.96 U$1.70
3C1
  Top 0.152: C3.A11 12.5,45.35 12.5,42.77 14.02,41.25 14.02,40.34 16.31,38.05 24.84,38.05 25.91,39.12 40.39,39.12 41.76,37.75 41.76,35.36 U$1.71
3C2
  Top 0.152: C3.A12 17.2,47.35 17.53,47.35 18.44,46.43 18.44,45.67 19.2,44.91 21.49,44.91 23.32,43.08 27.43,43.08 28.04,42.47 43.43,42.47 46.79,39.12 46.79,31.35 46.02,30.59 46.02,30.44 U$1.58
3C3
  Top 0.152: U$1.68 43.28,34.77 43.28,37.59 40.84,40.03 25.45,40.03 24.38,38.96 18.75,38.96 17.51,40.2 17.51,42.45 18.29,43.23 18.29,44.45 17.35,45.39 C3.A13
3D0  (via drill 0.33)
  Top 0.152: U$1.54 47.85,29.44 47.85,39.42 43.89,43.38 28.5,43.38 27.89,43.99 27.43,43.99 v26.82,44.6
  Bottom 0.152: v26.82,44.6 24.84,42.62 13.27,42.62 C3.B10
3D1  (via drill 0.33)
  Top 0.152: U$1.66 43.89,33.96 43.89,37.9 41.15,40.64 24.69,40.64 v23.93,39.88 | C3.B11 13.35,42.38 v16.61,39.12
  Bottom 0.152: v23.93,39.88 23.16,39.12 v16.61,39.12
3D2  (via drill 0.33)
  Top 0.152: U$1.65 44.2,33.56 44.2,38.05 41.3,40.95 23.47,40.95 v22.4,39.88
  Bottom 0.152: v22.4,39.88 18.17,39.88 C3.B12
3D3  (via drill 0.33)
  Top 0.152: U$1.46 45.72,23.89 45.72,24.33 47.09,25.71 47.4,25.71 47.85,25.25 48.46,25.25 49.38,26.16 49.38,28.75 49.07,29.06 49.07,31.04 v49.38,31.34 | v42.67,35.15 42.67,37.75 40.69,39.73 25.6,39.73 24.54,38.66 18.59,38.66 17.18,40.07 17.18,42.58 17.35,42.75 C3.B13
  Bottom 0.152: v49.38,31.34 45.57,35.15 v42.67,35.15
3E0  (via drill 0.33)
  Top 0.152: C3.A9 12.19,47.04 v12.34,47.04 | v43.28,41.71 46.48,38.51 46.48,31.6 U$1.59
  Bottom 0.152: v12.34,47.04 12.5,47.19 25.76,47.19 26.06,47.5 33.07,47.5 37.19,43.38 41.6,43.38 v43.28,41.71
3E1  (via drill 0.33)
  Top 0.152: U$1.73 41.15,36.17 41.15,37.44 40.08,38.51 26.21,38.51 25.15,37.44 15.39,37.44 v14.94,36.98
  Bottom 0.152: v14.94,36.98 11.35,40.57 C3.B9
3E2  (via drill 0.33)
  Top 0.152: U$1.44 44.96,23.23 44.96,24.03 46.94,26.01 47.55,26.01 47.85,25.71 48.46,25.71 49.07,26.31 49.07,28.6 48.77,28.91 48.77,39.88 44.81,43.84 v44.81,44.3 | v42.82,43.99 42.52,44.3 28.04,44.3 26.98,45.37 26.82,45.37 25.15,47.04 19.51,47.04 C3.A14
  Bottom 0.152: v44.81,44.3 44.5,43.99 v42.82,43.99
3E3  (via drill 0.33)
  Top 0.152: U$1.63 44.81,32.76 44.81,38.36 41.6,41.55 27.13,41.55 v26.82,41.86
  Bottom 0.152: C3.B14 19.56,40.49 25.45,40.49 v26.82,41.86
12V  (via drill 0.33)
  Top 0.381: C1.B8 C1.A8 10.35,22.95 v10.97,23.57 | v10.97,14.28 v10.97,7.72 10.52,7.72 | 10.52,7.72 10.52,3.72 C0.B8 | 10.52,7.72 10.52,15.95 10.36,16.1 | C3.A8 C3.B8 C2.A8 C2.B8 10.35,28.61 v10.97,27.99
  Bottom 0.381: v10.97,7.72 10.82,7.57 10.82,6.2 10.5,5.88 C0.B8 | v10.97,14.28 10.97,14.89 10.35,15.51 C3.A8 | v10.97,23.57 v10.97,27.99
G0  (via drill 0.33)
  Top 0.152: C2.B6 8.35,31.4 6.52,33.23 6.52,34.11 7.52,35.11 7.52,36.91 8.35,37.74 C3.B6 | C0.B6 8.53,3.73 8.53,7.72 8.23,8.03 8.23,10.92 | 8.23,10.92 8.23,13.06 8.53,13.36 8.53,16.02 C1.B6 8.35,18.4 6.52,20.23 6.52,21.19 7.51,22.18 7.51,23.92 v8.23,24.64 | U$1.27 41,15.18 41,11.68 40.84,11.53 20.73,11.53 v19.96,10.77 | v17.37,11.07 16.92,11.53 14.48,11.53 14.33,11.38 13.26,11.38 12.65,10.77 v12.04,10.77 | v8.38,10.77 8.23,10.92
  Bottom 0.152: v19.96,10.77 17.68,10.77 v17.37,11.07 | v8.38,10.77 v12.04,10.77 | C2.B6 8.35,24.76 v8.23,24.64
GND  (via drill 0.33)
  Top 0.152: LPWR.C 13.09,12.13 v12.65,11.68 | C0.B14 18.29,3.91 v18.29,6.96 | v19.66,8.33 21.03,8.33 23.01,10.31 41.6,10.31 42.22,10.92 42.22,16.79 U$1.31 | C9.2 27.25,26.16 U$1.100 | C10.2 32.23,34.55 U$1.84 | C11.2 37.45,36.26 37.64,36.07 v38.41,36.07
  Top 0.254: v2.44,36.83 3,37.39 G6.2 | v2.44,23.88 3,24.44 G5.2 | G4.2 3,11.41 C8.2 3.02,10.69 v3.02,10.04 | U$1.25 37.95,17.41 37.95,17.48 | U$1.100 29.45,26.01 29.57,26.01 | U$1.84 34.98,31.8 35.2,31.8 | U$1.75 38.54,34.98 | 38.54,34.98 38.25,34.69 38.25,34.39 | U$1.69 40.39,32.58 40.39,32.56 | U$1.62 42.73,29.97 42.67,29.97 | U$1.31 39.93,19.07 39.93,19.15 | U$1.21 36.4,18.7 36.58,18.7 | 38.54,34.98 38.41,35.11 v38.41,36.07 | G7.2 27.74,47.95 28.04,47.65 28.04,46.43 v28.96,45.52
  Top 0.305: U$1.21 34.59,16.89 34.59,16.41 33.53,15.34 v33.22,15.34
  Top 0.381: 6.5,6.45 6.5,16.85 5.35,18 C1.B3 5.35,18.4 4.36,19.39 4.36,21.11 5.95,22.7 C1.A4 C2.B4 5.35,30.2 C2.B3 5.35,31.4 4.36,32.39 4.36,34.11 6.35,36.1 6.35,42.2 5.35,43.2 C3.B3 6.4,44.75 6.4,48.26 | 38.41,14.12 C4.2 36.71,14.03 C6.2 C7.2 38.27,13.87 38.32,13.92 C5.2 37.95,14.49 37.95,17.48 37.95,17.63 | v5.94,12.14 v5.94,6.5 6,6.45 6.5,6.45 | 6.5,6.45 C0.B4
  Bottom 0.152: v12.65,11.68 12.65,12.14 | v18.29,6.96 v19.66,8.33 | C1.B14 18.29,16.14 18.29,14.58
  Bottom 0.254: C0.A3 5.6,3.8 5.6,6.35 5.8,6.55 5.9,6.55 | 4.34,44.94 4.34,43.3 1.83,40.79 1.83,36.83 | 1.83,36.83 v2.44,36.83 | 1.83,36.83 1.83,23.88 | 1.83,23.88 1.83,11.23 v3.02,10.04 | 1.83,23.88 v2.44,23.88 | v38.41,36.07 v28.96,45.52
  Bottom 0.381: 6.35,36.1 C3.B4 6.35,42.2 5.35,43.2 C3.B3 4.34,44.71 4.34,44.94 4.34,46.69 5.85,48.2 C3.A4 | C2.A4 6.35,32.82 5.35,31.82 C2.B3 5.35,30.2 C2.B4 C1.A4 6.35,20.02 5.64,19.3 5.64,17.51 6.35,16.8 C1.B4 6.35,12.55 v5.94,12.14 12.65,12.14 13.56,12.14 16,14.58 18.29,14.58 32.46,14.58 v33.22,15.34 | v5.94,6.5 5.9,6.55 6.35,6.55 6.35,3.85 C0.B4
  pour Top (isolate 0.381): 37.8,34.85 29.26,26.32 29.26,25.55 37.8,17.02 38.25,17.02 46.94,25.71 46.94,26.32 38.4,34.85
GRST
  Top 0.152: 7.2,26.16 7.2,22.35 6.2,21.35 6.2,19.35 C1.B5 7.32,18.16 7.32,15.5 7.01,15.19 7.01,6.05 7.5,5.56 C0.B5 | 7.2,26.16 7.2,31.05 C2.B5 6.19,32.36 6.19,34.22 7.21,35.24 7.21,43.56 C3.B5 | U$1.99 28.03,28.14 27.74,28.14 23.47,23.88 15.09,23.88 13.11,21.9 12.8,21.9 12.65,21.74 12.04,21.74 11.43,22.35 11.43,23.11 12.04,23.72 12.04,24.49 10.36,26.16 7.2,26.16
N$25
  Top 0.152: LPWR.A R5.1
SCL  (via drill 0.33)
  Top 0.152: v7.62,7.27 7.47,7.42 7.47,13.67 v7.62,13.82
  Bottom 0.152: C3.A5 6.2,45.05 6.2,43.04 7.2,42.04 7.2,33.85 C2.A5 7.35,32.94 6.18,31.77 6.18,30.57 7.2,29.55 7.2,20.85 C1.A5 7.35,19.95 6.2,18.8 6.2,17.73 7.2,16.73 7.2,15.51 7.05,15.36 7.05,14.39 v7.62,13.82 | C0.A5 7.5,5.53 7.05,5.98 7.05,6.69 v7.62,7.27
SDA  (via drill 0.33)
  Top 0.152: v7.77,6.35 8.23,6.81 8.23,7.57 7.77,8.03 7.77,13.06 8.23,13.51 8.23,14.28 v7.77,14.73 | v9.6,47.35 9.2,47.35 C3.A6
  Bottom 0.152: C0.A6 8.5,5.62 v7.77,6.35 | v7.77,14.73 7.77,15.18 7.51,15.44 7.51,16.86 6.52,17.85 6.52,18.67 8.35,20.5 C1.A6 7.52,23.53 7.52,29.67 6.5,30.69 6.5,31.65 8.35,33.5 C2.A6 7.52,36.53 7.52,42.3 6.51,43.31 6.51,44.07 8.38,45.94 8.38,46.58 9.14,47.35 v9.6,47.35
SENSE0  (via drill 0.33)
  Top 0.152: C0.B3 5.5,5.88 5.33,6.05 5.33,6.96 5.49,7.11 5.49,10.31 v5.03,10.77 5.29,10.51
  Top 0.254: R1.1 2.35,14.06 | 2.35,14.06 G4.6 | 2.35,14.06 2.35,13.75 2.59,13.51 v4.57,13.51
  Bottom 0.254: v4.57,13.51 4.57,11.23 v5.03,10.77
SENSE1  (via drill 0.33)
  Top 0.254: R2.1 2.25,26.35 | 2.25,26.35 2.35,26.45 G5.6 | v4.42,26.16 2.44,26.16 2.25,26.35
  Bottom 0.254: C1.A3 5.35,25.23 v4.42,26.16
SENSE2  (via drill 0.33)
  Top 0.254: v4.27,38.96 2.74,38.96 2.35,39.36 | 2.35,39.36 G6.6 | R3.1 2.24,39.36 2.35,39.36
  Bottom 0.254: C2.A3 5.35,37.88 v4.27,38.96
SENSE3  (via drill 0.33)
  Top 0.152: R4.1 31.41,48.6 G7.6 28.96,48.66 v28.96,49.28
  Bottom 0.152: v28.96,49.28 10.01,49.28 9.45,48.72 9.45,48.11 8.38,47.04 6.19,47.04 C3.A3
TCK  (via drill 0.33)
  Top 0.152: C1.B2 5.49,15.06 5.49,13.06 4.35,11.92 4.35,10.23 5.18,9.4 5.18,7.57 4.57,6.96 4.57,3.77 C0.B2 | U$1.48 48.06,22.96 v48.16,22.96
  Top 0.254: C1.B2 4.4,16.25 4.4,18.55 3.4,19.55 2.8,19.55 2.4,19.95 2.4,21.4 3.35,22.35 3.35,22.96 5.64,25.25 5.64,27.91 C2.B2 4.35,31.6 3.6,32.35 3,32.35 2.4,32.95 2.4,34.51 3.35,35.46 3.35,36.07 5.03,37.75 5.03,41.02 C3.B2
  Bottom 0.152: v48.16,22.96 47.55,22.35 47.55,21.29 42.06,15.8 39.62,15.8 37.95,14.12 16.31,14.12 12.04,9.86 7.01,9.86 5.03,11.84 5.03,12.6 5.41,12.98 5.41,15.14 C1.B2
TDI
  Top 0.152: G4.3 3.81,12.39 3.81,10.29 4.88,9.23 4.88,7.72 3.5,6.35 C0.B1
TDI1
  Top 0.254: G4.4 3.65,15.5 3.35,15.8 C1.B1 1.75,19.8 1.75,24.25 2.35,24.86 G5.1
TDI2
  Top 0.254: G5.4 3.65,28.5 3.35,28.8 C2.B1 1.75,32.8 1.75,37.45 G6.1
TDI3
  Top 0.152: C3.B1 2.2,44.85 2.2,48.15 3.43,49.38 26.32,49.38 G7.1
  Top 0.254: G6.4 3.65,40.7 3.4,40.95 3.4,43.65 C3.B1
TDIC  (via drill 0.33)
  Top 0.152: U$1.45 46.94,21.96 v46.94,21.9 | G7.4 29.76,47.3 30.02,47.04 v30.02,45.98
  Bottom 0.152: v46.94,21.9 46.94,22.66 48.77,24.49 48.77,27.38 46.63,29.52 45.87,29.52 30.02,45.37 v30.02,45.98
TDO1  (via drill 0.33)
  Top 0.254: v2.59,22.66 2.59,22.96 3.65,24.02 G5.3
  Bottom 0.254: C1.A1 3.35,21.9 v2.59,22.66
TDO2  (via drill 0.33)
  Top 0.254: v2.59,35.76 2.59,35.92 3.65,36.98 G6.3
  Bottom 0.254: C2.A1 2.59,34.46 v2.59,35.76
TDO3
  Top 0.152: G7.3 26.25,47.3 24.49,49.06 3.91,49.06 3.2,48.35 3.2,46.35 C3.A1
TDO/TDOC  (via drill 0.33)
  Top 0.152: 1.98,11.84 1.98,10.02 2.9,9.09 v3.2,9.09 v4.27,8.03 | v30.33,35.46 32.03,35.46 U$1.83 | v11.73,8.33 11.43,8.64 11.43,13.21 v11.73,13.51
  Top 0.254: 1.98,11.84 2.35,12.21 G4.1
  Bottom 0.152: v11.73,8.33 4.57,8.33 v4.27,8.03 | v3.2,9.09 3.35,8.94 3.35,3.85 C0.A1 | v30.33,35.46 30.33,32.87 23.62,26.16 23.62,21.59 21.49,19.46 17.22,19.46 14.48,16.71 14.48,15.95 12.04,13.51 v11.73,13.51
TMS  (via drill 0.33)
  Top 0.152: U$1.47 47.4,22.92 47.4,22.81 v48.16,22.05
  Top 0.254: C2.A2 5.64,36.99 5.64,41.1 5.33,41.4 5.33,42.32 4.35,43.3 C3.A2
  Bottom 0.152: v48.16,22.05 48.16,21.44 42.22,15.5 39.78,15.5 38.1,13.82 16.46,13.82 12.19,9.55 4.5,9.55 4.27,9.32 4.27,8.94 3.66,8.33 3.66,6.2 4.5,5.36 C0.A2
  Bottom 0.254: 4.5,9.55 4.5,10.08 3.35,11.23 3.35,16.71 4.35,17.71 C1.A2 3.35,23.7 3.35,29.67 4.35,30.66 C2.A2

### Text on the board
tPlace: Serial | CPLD: 64 128 256 | MB Backplane S4 v1.0 / MB v1.0 / 10-21-13